# EAGLE schematic Basic-Computer (EAGLE 9.4.2)
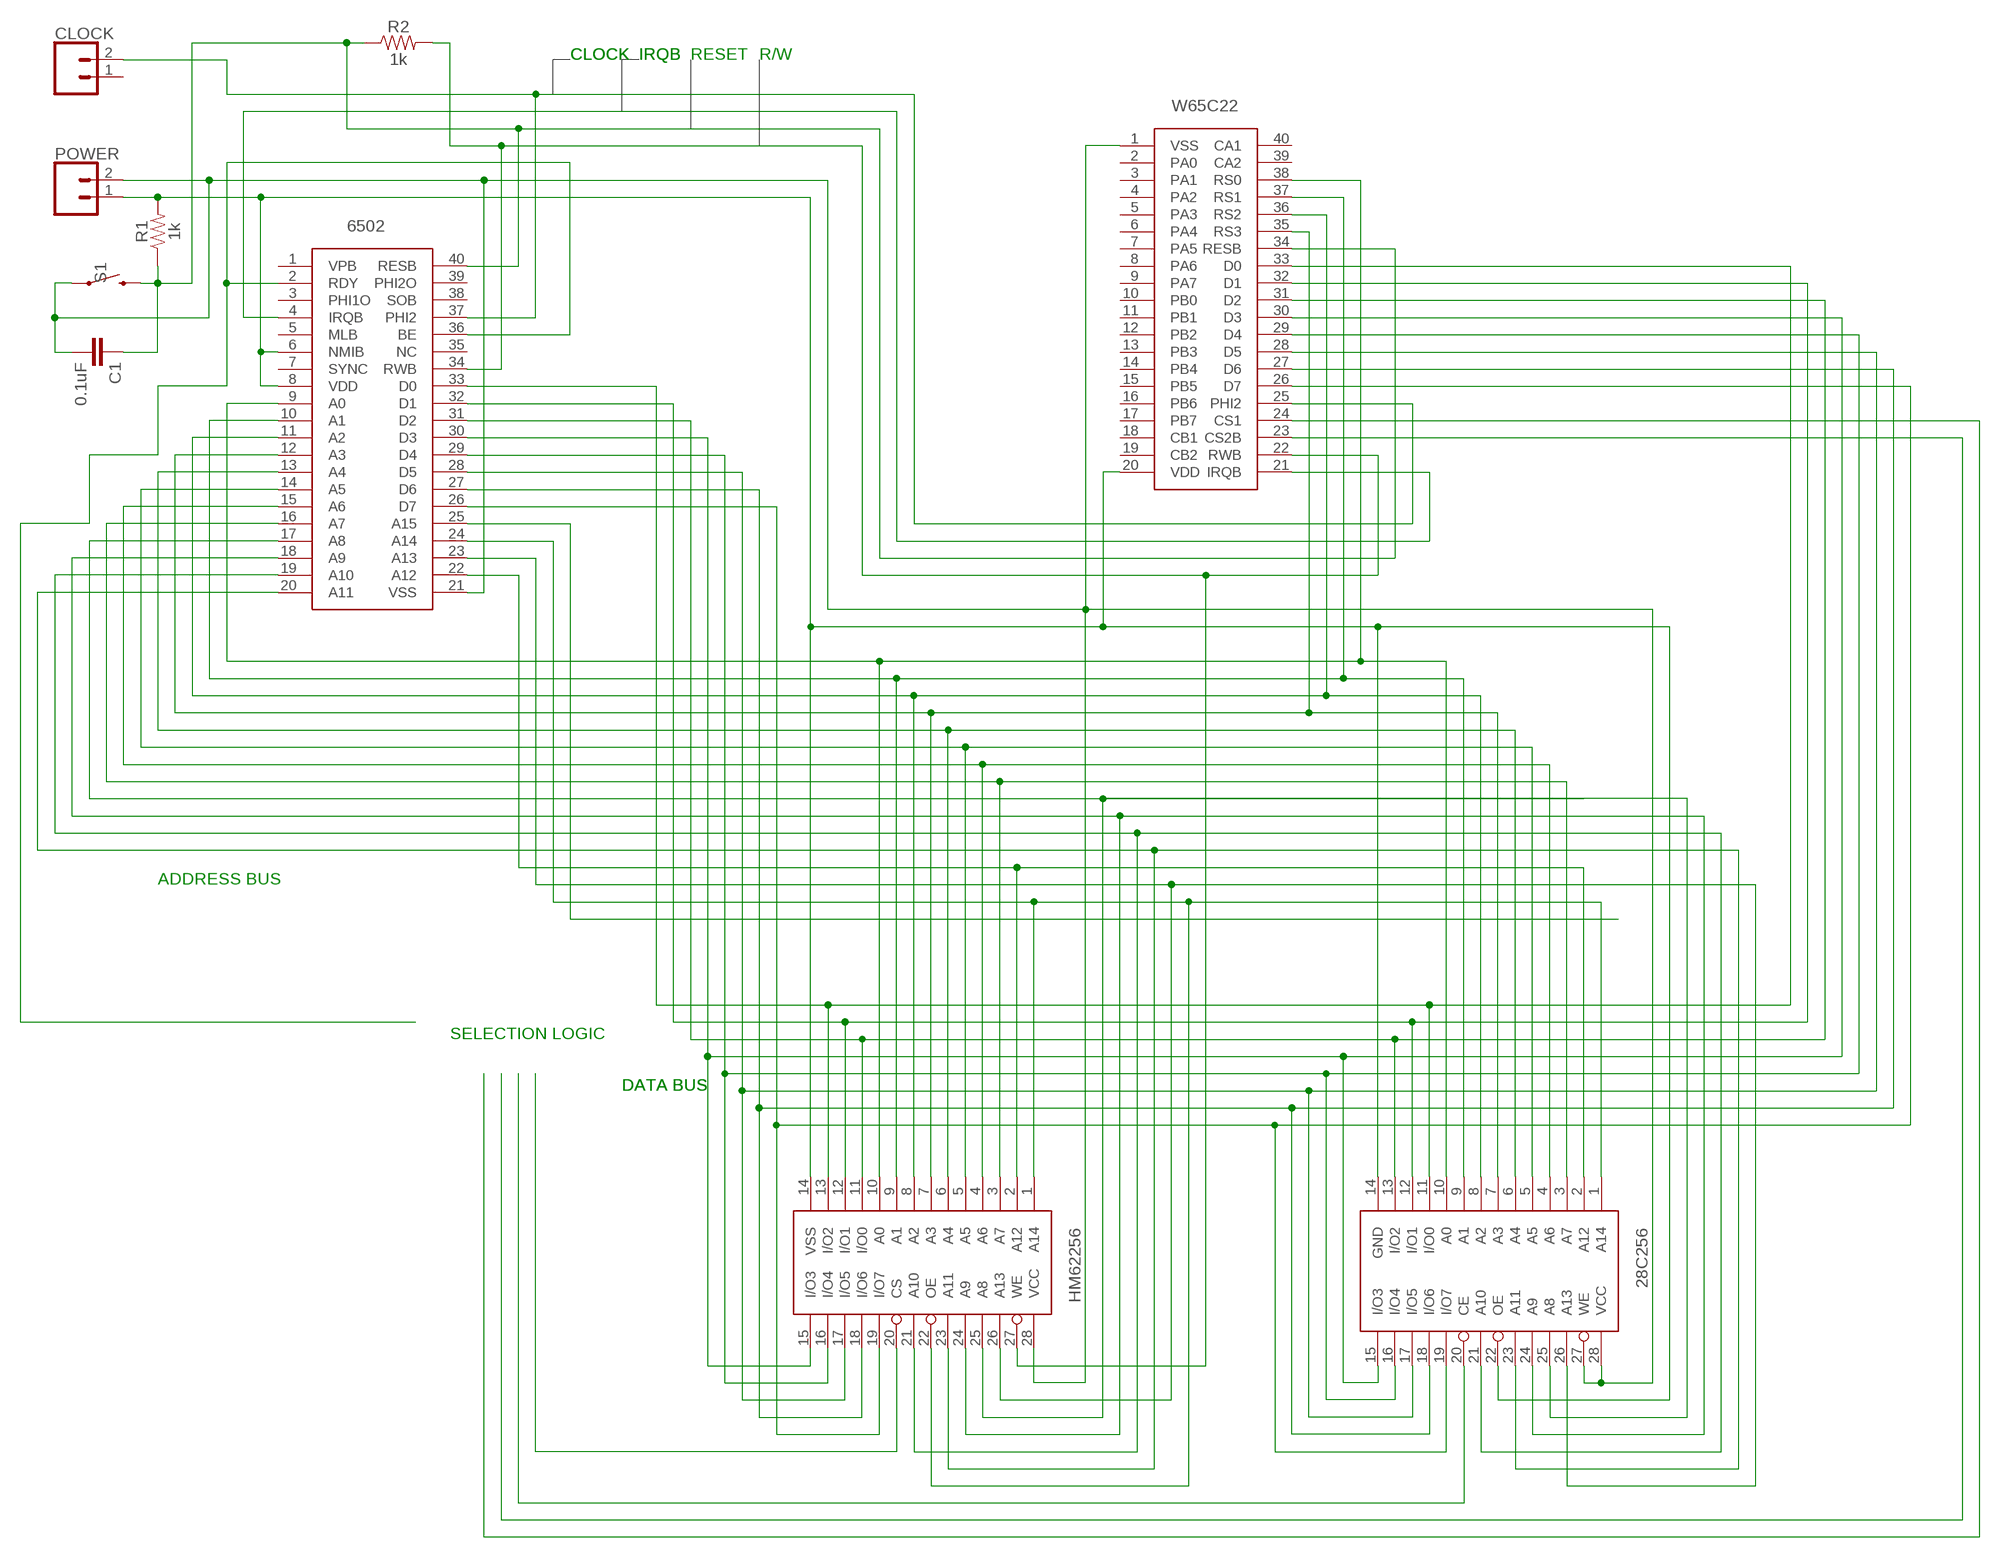
[diagram p0: schematic, sheet 1]

## Parts
C1  0.1uF  0.1UF-0402-16V-10%  [0402]
CLOCK  CONN_02POGO_PIN_HOLES_ONLY  [1X02_PP_HOLES_ONLY]
POWER  CONN_02POGO_PIN_HOLES_ONLY  [1X02_PP_HOLES_ONLY]
R1  1k  1KOHM-HORIZ-1/4W-5%  [AXIAL-0.3]
R2  1k  1KOHM-HORIZ-1/4W-5%  [AXIAL-0.3]
S1  MOMENTARY-SWITCH-SPST-PTH-6.0MM  [TACTILE_SWITCH_PTH_6.0MM]
U$1  C6502  [DIP1150W53P250L4975H200Q40B]
U$2  W65C22  [DIP1150W53P250L4975H200Q40B]
U$3  28C256  [DIP1722W26P254L3450H508Q28B]
U$4  HM62256  [DIP1722W26P254L3450H508Q28B]

## Nets
N$1: POWER.1 R1.P$2 U$1.6(NMIB) U$1.8(VDD) U$2.20(VDD) U$3.14(GND) U$3.22(OE) U$4.14(VSS)
N$2: C1.2 POWER.2 S1.1 U$1.21(VSS) U$2.1(VSS) U$3.27(WE) U$3.28(VCC) U$4.28(VCC)
N$3: U$1.32(D1) U$2.32(D1) U$3.12(I/O1) U$4.12(I/O1)
N$4: U$1.9(A0) U$2.38(RS0) U$3.10(A0) U$4.10(A0)
N$5: U$1.10(A1) U$2.37(RS1) U$3.9(A1) U$4.9(A1)
N$6: U$1.11(A2) U$2.36(RS2) U$3.8(A2) U$4.8(A2)
N$7: U$1.12(A3) U$2.35(RS3) U$3.7(A3) U$4.7(A3)
N$8: U$1.13(A4) U$3.6(A4) U$4.6(A4)
N$9: U$1.14(A5) U$3.5(A5) U$4.5(A5)
N$10: U$1.15(A6) U$3.4(A6) U$4.4(A6)
N$11: U$1.16(A7) U$3.3(A7) U$4.3(A7)
N$12: U$1.17(A8) U$3.25(A8) U$4.25(A8)
N$13: U$1.18(A9) U$3.24(A9) U$4.24(A9)
N$14: U$1.19(A10) U$3.21(A10) U$4.21(A10)
N$15: U$1.20(A11) U$3.23(A11) U$4.23(A11)
N$16: U$1.33(D0) U$2.33(D0) U$3.11(I/O0) U$4.13(I/O2)
N$17: U$1.31(D2) U$2.31(D2) U$3.13(I/O2) U$4.11(I/O0)
N$18: U$1.30(D3) U$2.30(D3) U$3.15(I/O3) U$4.15(I/O3)
N$19: U$1.29(D4) U$2.29(D4) U$3.16(I/O4) U$4.16(I/O4)
N$20: U$1.28(D5) U$2.28(D5) U$3.17(I/O5) U$4.17(I/O5)
N$21: U$1.27(D6) U$2.27(D6) U$3.18(I/O6) U$4.18(I/O6)
N$22: U$1.26(D7) U$2.26(D7) U$3.19(I/O7) U$4.19(I/O7)
N$23: U$1.22(A12) U$3.2(A12) U$4.2(A12)
N$24: U$1.23(A13) U$3.26(A13) U$4.26(A13)
N$25: U$1.24(A14) U$3.1(A14) U$4.1(A14) U$4.22(OE)
N$26: U$1.25(A15)
N$27: C1.1 R1.P$1 R2.P$1 S1.3 U$1.40(RESB) U$2.34(RESB)
N$28: R2.P$2 U$1.34(RWB) U$2.22(RWB) U$4.27(WE)
N$29: U$1.4(IRQB) U$2.21(IRQB)
N$30: CLOCK.2 U$1.37(PHI2) U$2.25(PHI2)
N$31: U$1.2(RDY) U$1.36(BE)
N$32: U$4.20(CS)
N$33: U$3.20(CE)
N$34: U$2.23(CS2B)
N$35: U$2.24(CS1)
Unconnected: CLOCK.1 U$1.1(VPB) U$1.3(PHI1O) U$1.5(MLB) U$1.7(SYNC) U$1.35(NC) U$1.38(SOB) U$1.39(PHI2O) U$2.2(PA0) U$2.3(PA1) U$2.4(PA2) U$2.5(PA3) U$2.6(PA4) U$2.7(PA5) U$2.8(PA6) U$2.9(PA7) U$2.10(PB0) U$2.11(PB1) U$2.12(PB2) U$2.13(PB3) U$2.14(PB4) U$2.15(PB5) U$2.16(PB6) U$2.17(PB7) U$2.18(CB1) U$2.19(CB2) U$2.39(CA2) U$2.40(CA1)

## Notes on the sheet
- CLOCK | CLOCK | IRQB | IRQB | RESET | R/W
- ADDRESS BUS
- SELECTION LOGIC
- DATA BUS | DATA BUS

## Library data of the parts
C1 = SparkFun-Capacitors:0.1UF: 0.1µF ceramic capacitors A capacitor is a passive two-terminal electrical component used to store electrical energy temporarily in an electric field.; PROD_ID: CAP-12416
CLOCK POWER = SparkFun-Connectors:CONN_02: Multi connection point. Often used as Generic Header-pin footprint for 0.1 inch spaced/style header connections On any of the 0.1 inch spaced packages, you can populate with these: Break Away Headers - Straight <https://www.sparkfun.com/products/116> (PRT-00116) Break Away Male Headers - Right Angle <https://www.sparkfun.com/products/553> (PRT-00553) Female Headers <https://www.sparkfun.com/products/115> (PRT-00115) Break Away Headers - Machine Pin <https://www.sparkfun.com/products/117> (PRT-00117) Break Away Female Headers - Swiss Machine Pin <https://www.sparkfun.com/products/743> (PRT-00743) For SCREWTERMINALS and SPRING TERMINALS visit here: Screw Terimnals on SparkFun.com <https://www.sparkfun.com/search/results?term=Screw+Terminals> (5mm/3.5mm/2.54mm spacing) This device is also useful as a general connection point to wire up your design to another part of your project. Our various solder wires solder well into these plated through hole pads. Hook-Up Wire - Assortment (Stranded, 22 AWG) <https://www.sparkfun.com/products/11375> (PRT-11375) Hook-Up Wire - Assortment (Solid Core, 22 AWG) <https://www.sparkfun.com/products/11367> (PRT-11367) View the entire wire category on our website here <https://www.sparkfun.com/categories/141> Special notes: Molex polarized connector foot print use with: PRT-08233 with associated crimp pins and housings. 2.54_SCREWTERM for use with PRT-10571. 3.5mm Screw Terminal footprints for PRT-08084 5mm Screw Terminal footprints for use with PRT-08432
R1 R2 = SparkFun-Resistors:1KOHM: 1kΩ resistor A resistor is a passive two-terminal electrical component that implements electrical resistance as a circuit element. Resistors act to reduce current flow, and, at the same time, act to lower voltage levels within circuits. - Wikipedia; PROD_ID: RES-08380
S1 = SparkFun-Switches:MOMENTARY-SWITCH-SPST: Momentary Switch (Pushbutton) - SPST Normally-open (NO) SPST momentary switches (buttons, pushbuttons). Variants PTH-12MM - 12mm square, through-hole Momentary Pushbutton Switch - 12mm Square <https://www.sparkfun.com/products/9190> (COM-09190) PTH-6.0MM, PTH-6.0MM-KIT - 6.0mm square, through-hole Mini Pushbutton Switch <https://www.sparkfun.com/products/97> (COM-00097) KIT package intended for soldering kit's - only one side of pads' copper is exposed. PTH-RIGHT-ANGLE-KIT - Right-angle, through-hole Right Angle Tactile Button <https://www.sparkfun.com/products/10791> - Used on SparkFun BigTime Watch Kit <https://www.sparkfun.com/products/11734> SMD-12MM - 12mm square, surface-mount Tactile Button - SMD (12mm) <https://www.sparkfun.com/products/12993> (COM-12993) Used on SparkFun PicoBoard <https://www.sparkfun.com/products/11888> SMD-4.5MM - 4.5mm Square Trackball Switch Used on SparkFun Blackberry Trackballer Breakout <https://www.sparkfun.com/products/13169> SMD-4.6MMX2.8MM - 4.60mm x 2.80mm, surface mount Used on SparkFun SAMD21 Mini Breakout <https://www.sparkfun.com/products/13664> SMD-5.2MM, SMD-5.2-REDUNDANT - 5.2mm square, surface-mount Mini Pushbutton Switch - SMD <https://www.sparkfun.com/products/8720> (COM-08720) Used on Arduino Pro Mini <https://www.sparkfun.com/products/11114> REDUNDANT package connects both switch circuits together SMD-6.0X3.5MM - 6.0 x 3.5mm, surface mount Momentary Reset Switch SMD <https://www.sparkfun.com/products/8229> (COM-08229) SMD-6.2MM-TALL - 6.2mm square, surface mount Tactile Button - SMD (6mm) <https://www.sparkfun.com/products/12992> Used on SparkFun Digital Sandbox <https://www.sparkfun.com/products/12651> SMD-RIGHT-ANGLE - Right-angle, surface mount Used on SparkFun Block for Intel® Edison - Arduino <https://www.sparkfun.com/products/13036>; PROD_ID: SWCH-08441; SF_SKU: COM-00097
U$1 = Computer_Parts:C6502
U$2 = Computer_Parts:W65C22
U$3 = Computer_Parts:28C256
U$4 = Computer_Parts:HM62256